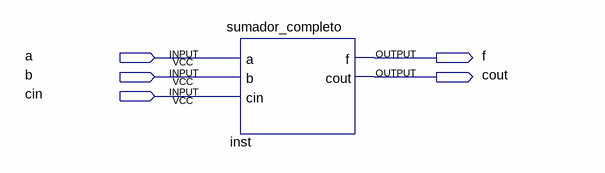
[diagram p0: schematic sheet]
// Quartus schematic Block1.bdf as structural Verilog: 1 symbols, 5 pins
module Block1 (
  input  a,
  input  b,
  input  cin,
  output f,
  output cout
);

  sumador_completo inst (.a(a), .b(b), .cin(cin), .f(f), .cout(cout));
endmodule
